# Altium schematic sheet cover_page.SchDoc: Cover Page
size B; Organization: Altium Limited; Address1: L3, 12a Rodborough Rd; Address2: Frenchs Forest; Address3: NSW; Address4: Australia 2086; Revision: A; SheetNumber: 1; SheetTotal: 7; Variant: Prototype
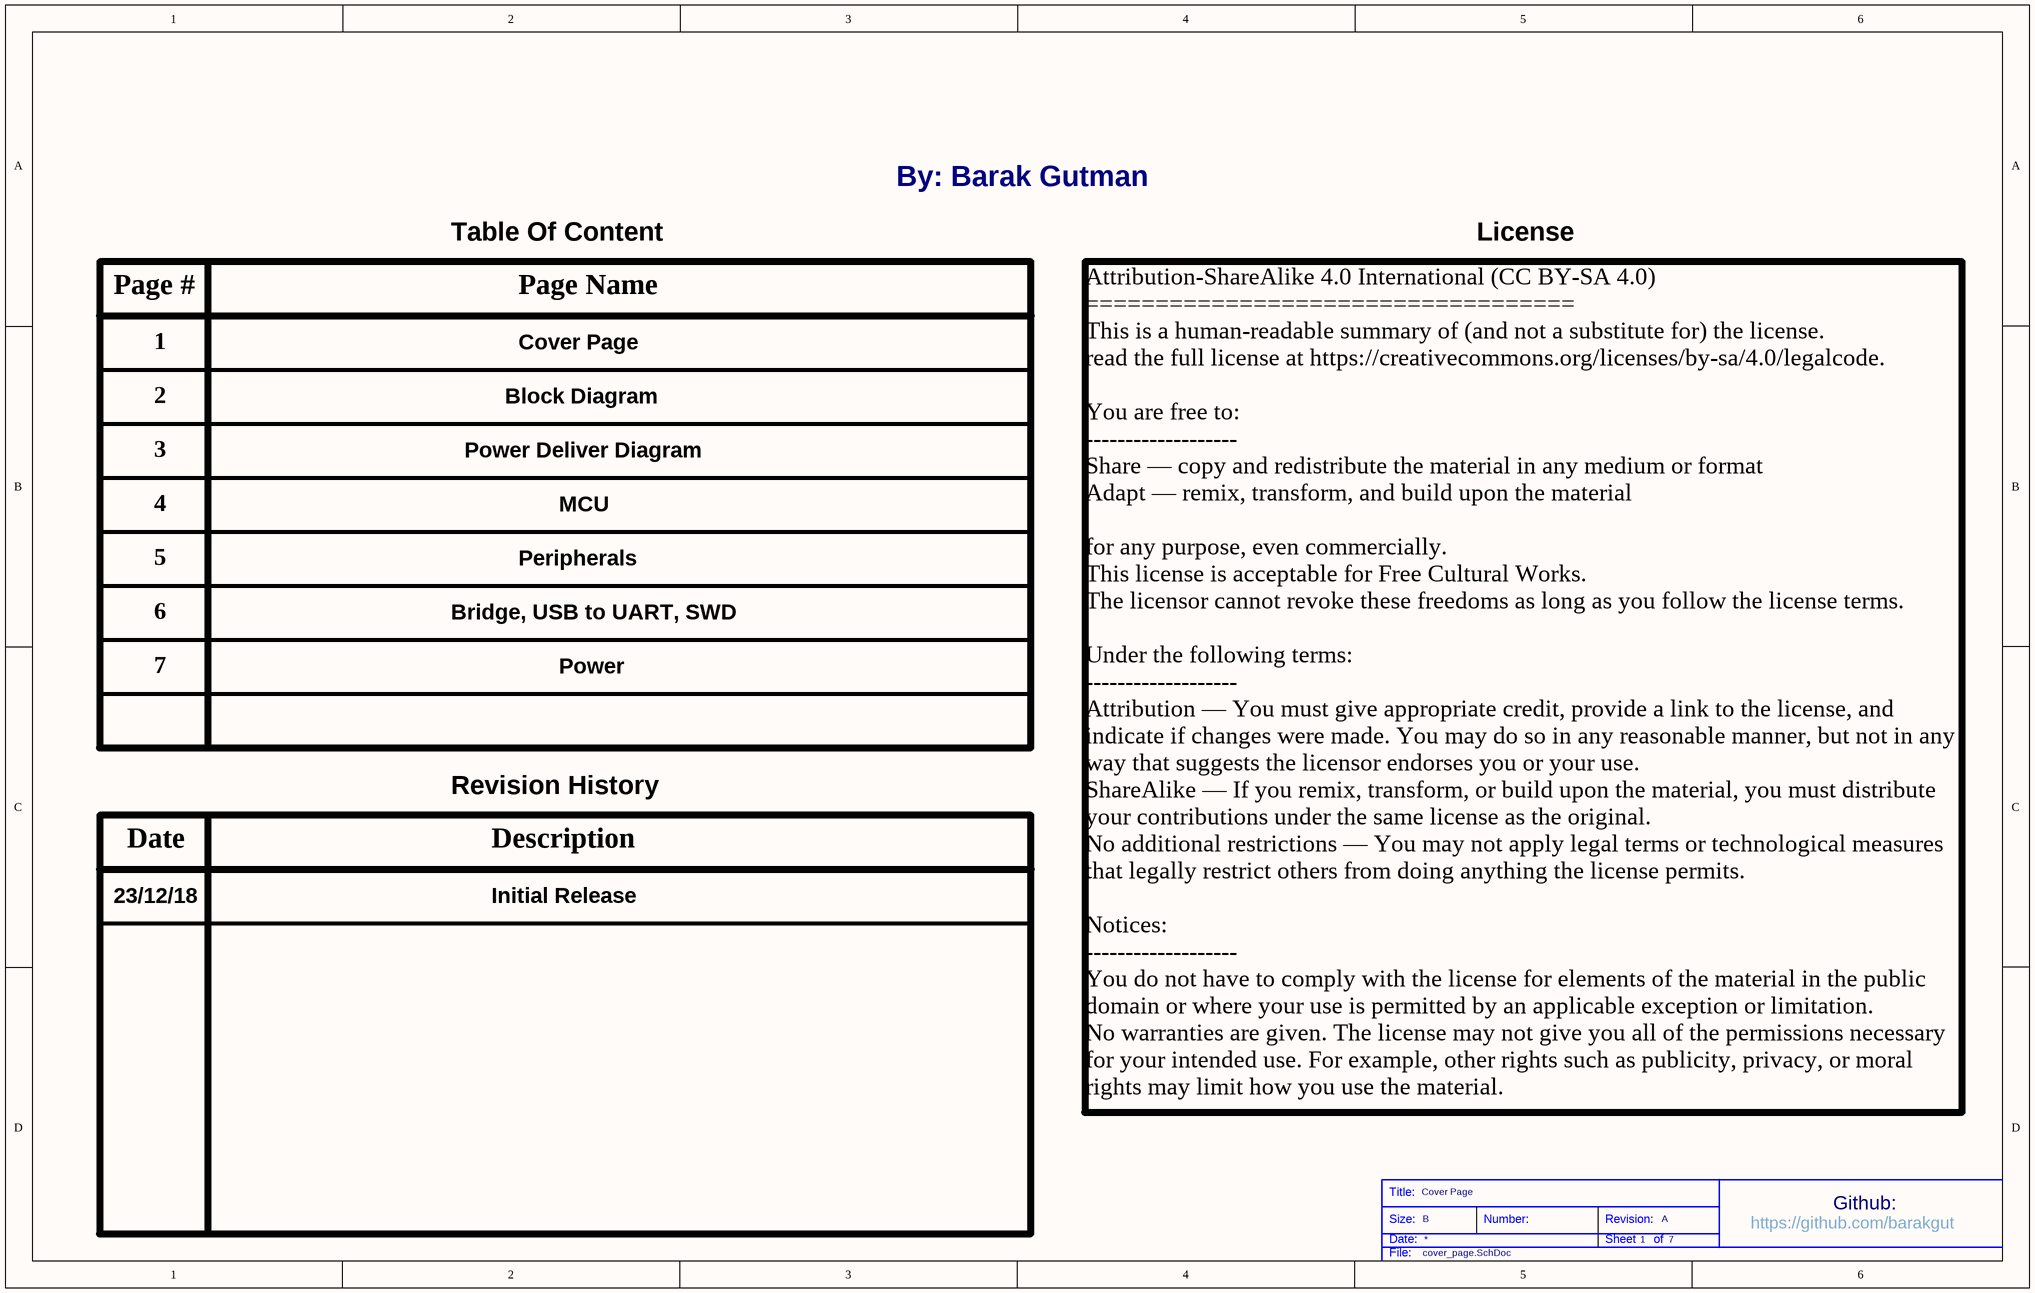
[diagram p0: cover_page.SchDoc]

## Notes on the sheet
- By: Barak Gutman
- Page #
- Table Of Content
- Page Name
- License
- 1
- Cover Page
- 2
- Block Diagram
- 3
- Power Deliver Diagram
- 4
- 5
- Peripherals
- MCU
- 6
- Bridge, USB to UART, SWD
- 7
- Power
- Revision History
- 23/12/18
- Date
- Description
- Initial Release
- Attribution-ShareAlike 4.0 International (CC BY-SA 4.0)
  ===================================
  This is a human-readable summary of (and not a substitute for) the license.
  read the full license at https://creativecommons.org/licenses/by-sa/4.0/legalcode.
  You are free to:
  -------------------
  Share — copy and redistribute the material in any medium or format
  Adapt — remix, transform, and build upon the material
  for any purpose, even commercially.
  This license is acceptable for Free Cultural Works.
  The licensor cannot revoke these freedoms as long as you follow the license terms.
  Under the following terms:
  -------------------
  Attribution — You must give appropriate credit, provide a link to the license, and indicate if changes were made. You may do so in any reasonable manner, but not in any way that suggests the licensor endorses you or your use.
  ShareAlike — If you remix, transform, or build upon the material, you must distribute your contributions under the same license as the original.
  No additional restrictions — You may not apply legal terms or technological measures that legally restrict others from doing anything the license permits.
  Notices:
  -------------------
  You do not have to comply with the license for elements of the material in the public domain or where your use is permitted by an applicable exception or limitation.
  No warranties are given. The license may not give you all of the permissions necessary for your intended use. For example, other rights such as publicity, privacy, or moral rights may limit how you use the material.
- Title:
- Size:
- Date:
- B
- Number:
- Revision:
- Sheet
- of
- https://github.com/barakgut
- Github:
- File: